# Altium schematic sheet PowCarbinBoard_Isolation.SchDoc
size A3
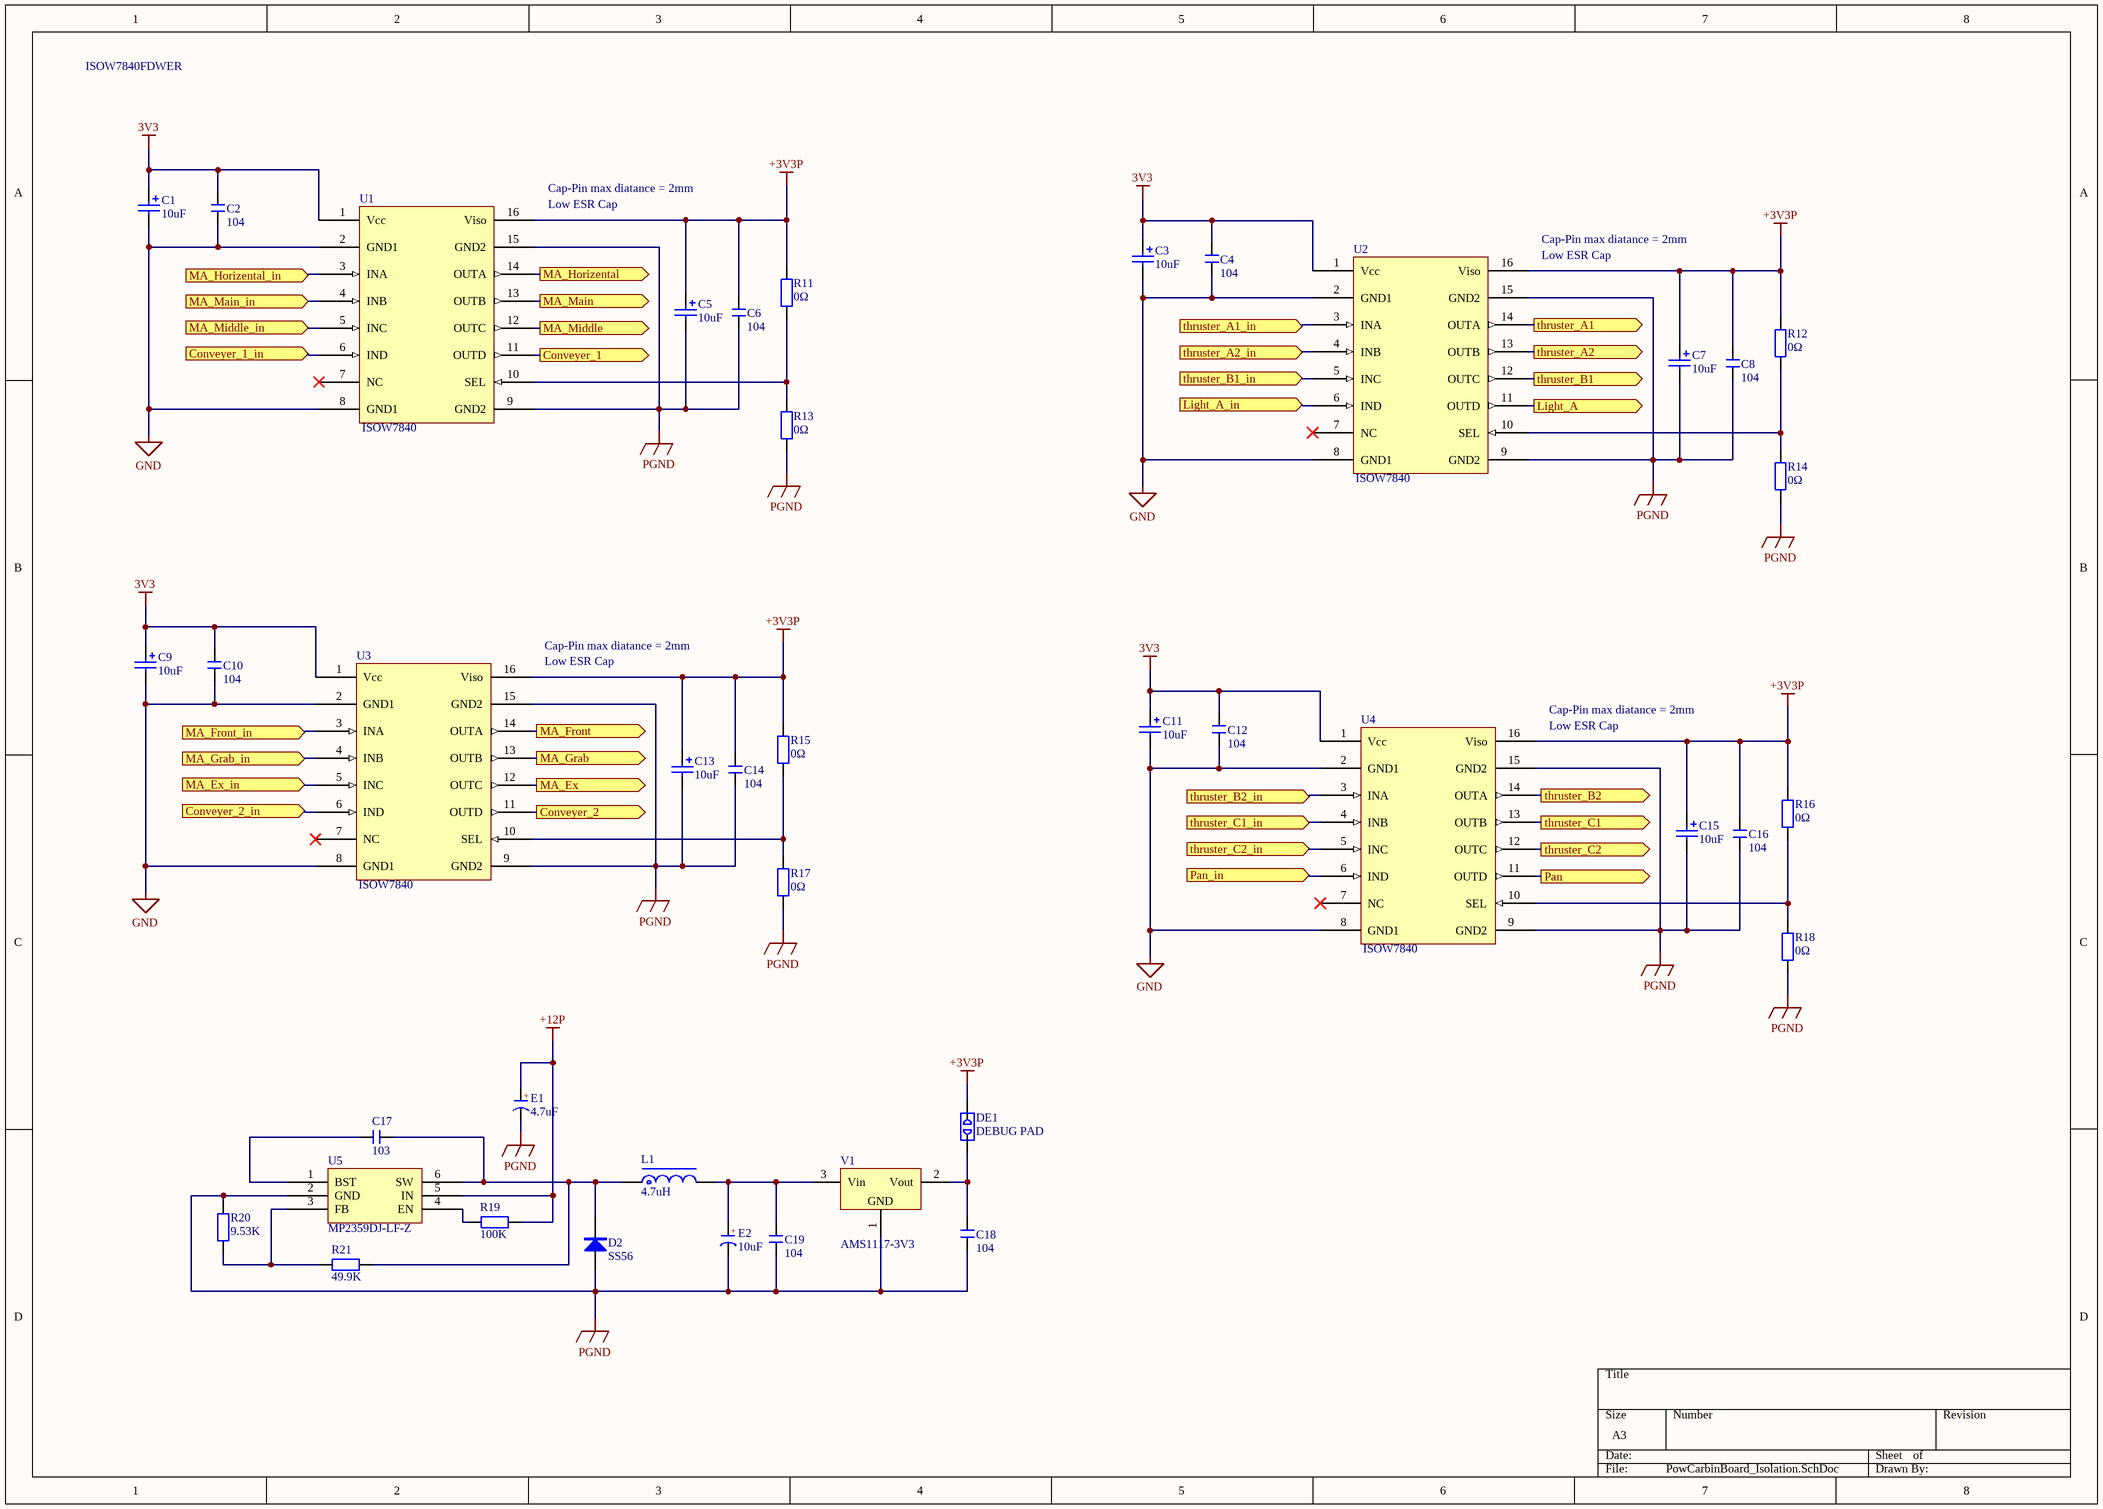
[diagram p0: PowCarbinBoard_Isolation.SchDoc]

## Parts
C1  10uF  [CASE-B_3528]
C2  104  [C 0603_L]
C3  10uF  [CASE-B_3528]
C4  104  [C 0603_L]
C5  10uF  [CASE-B_3528]
C6  104  [C 0603_L]
C7  10uF  [CASE-B_3528]
C8  104  [C 0603_L]
C9  10uF  [CASE-B_3528]
C10  104  [C 0603_L]
C11  10uF  [CASE-B_3528]
C12  104  [C 0603_L]
C13  10uF  [CASE-B_3528]
C14  104  [C 0603_L]
C15  10uF  [CASE-B_3528]
C16  104  [C 0603_L]
C17  103  [C 0603_L]
C18  104  [C 0603_L]
C19  104  [C 0603_L]
D2  SS56  [SMA]
DE1  DEBUG PAD  [DEBUG_A]
E1  4.7uF  [CM B(4*5.4)]
E2  10uF  [CM B(4*5.4)]
L1  4.7uH  [CDRH74]
R11  0Ω  [R 0603_L]
R12  0Ω  [R 0603_L]
R13  0Ω  [R 0603_L]
R14  0Ω  [R 0603_L]
R15  0Ω  [R 0603_L]
R16  0Ω  [R 0603_L]
R17  0Ω  [R 0603_L]
R18  0Ω  [R 0603_L]
R19  100K  [R 0603_L]
R20  9.53K  [R 0603_L]
R21  49.9K  [R 0603_L]
U1  ISOW7840  [ISOW7840]
U2  ISOW7840  [ISOW7840]
U3  ISOW7840  [ISOW7840]
U4  ISOW7840  [ISOW7840]
U5  MP2359DJ-LF-Z  [SOT-23-6]
V1  AMS1117-3V3  [SOT89_N]

## Ports
Conveyer_1 (out), Conveyer_1_in (in), Conveyer_2 (out), Conveyer_2_in (in), Light_A (out), Light_A_in (in), MA_Ex (out), MA_Ex_in (in), MA_Front (out), MA_Front_in (in), MA_Grab (out), MA_Grab_in (in), MA_Horizental (out), MA_Horizental_in (in), MA_Main (out), MA_Main_in (in), MA_Middle (out), MA_Middle_in (in), Pan (out), Pan_in (in), thruster_A1 (out), thruster_A1_in (in), thruster_A2 (out), thruster_A2_in (in), thruster_B1 (out), thruster_B1_in (in), thruster_B2 (out), thruster_B2_in (in), thruster_C1 (out), thruster_C1_in (in), thruster_C2 (out), thruster_C2_in (in)

## Nets
3V3: C1.1 C2.2 C3.1 C4.2 C9.1 C10.2 C11.1 C12.2 U1.1(Vcc) U2.1(Vcc) U3.1(Vcc) U4.1(Vcc)
+3V3P: C5.1 C6.2 C7.1 C8.2 C13.1 C14.2 C15.1 C16.2 DE1.2 R11.2 R12.2 R15.2 R16.2 U1.16(Viso) U2.16(Viso) U3.16(Viso) U4.16(Viso)
+12P: E1.1(A) R19.1 U5.5(IN)
GND: C1.2 C2.1 C3.2 C4.1 C9.2 C10.1 C11.2 C12.1 U1.2(GND1) U1.8(GND1) U2.2(GND1) U2.8(GND1) U3.2(GND1) U3.8(GND1) U4.2(GND1) U4.8(GND1)
PGND: C5.2 C6.1 C7.2 C8.1 C13.2 C14.1 C15.2 C16.1 C18.1 C19.1 D2.1(A) E1.2(K) E2.2(K) R13.1 R14.1 R17.1 R18.1 R20.2 U1.9(GND2) U1.15(GND2) U2.9(GND2) U2.15(GND2) U3.9(GND2) U3.15(GND2) U4.9(GND2) U4.15(GND2) U5.2(GND) V1.1(GND)
Conveyer_1: U1.11(OUTD) ; port Conveyer_1
Conveyer_1_in: U1.6(IND) ; port Conveyer_1_in
Conveyer_2: U3.11(OUTD) ; port Conveyer_2
Conveyer_2_in: U3.6(IND) ; port Conveyer_2_in
Light_A: U2.11(OUTD) ; port Light_A
Light_A_in: U2.6(IND) ; port Light_A_in
MA_Ex: U3.12(OUTC) ; port MA_Ex
MA_Ex_in: U3.5(INC) ; port MA_Ex_in
MA_Front: U3.14(OUTA) ; port MA_Front
MA_Front_in: U3.3(INA) ; port MA_Front_in
MA_Grab: U3.13(OUTB) ; port MA_Grab
MA_Grab_in: U3.4(INB) ; port MA_Grab_in
MA_Horizental: U1.14(OUTA) ; port MA_Horizental
MA_Horizental_in: U1.3(INA) ; port MA_Horizental_in
MA_Main: U1.13(OUTB) ; port MA_Main
MA_Main_in: U1.4(INB) ; port MA_Main_in
MA_Middle: U1.12(OUTC) ; port MA_Middle
MA_Middle_in: U1.5(INC) ; port MA_Middle_in
Pan: U4.11(OUTD) ; port Pan
Pan_in: U4.6(IND) ; port Pan_in
thruster_A1: U2.14(OUTA) ; port thruster_A1
thruster_A1_in: U2.3(INA) ; port thruster_A1_in
thruster_A2: U2.13(OUTB) ; port thruster_A2
thruster_A2_in: U2.4(INB) ; port thruster_A2_in
thruster_B1: U2.12(OUTC) ; port thruster_B1
thruster_B1_in: U2.5(INC) ; port thruster_B1_in
thruster_B2: U4.14(OUTA) ; port thruster_B2
thruster_B2_in: U4.3(INA) ; port thruster_B2_in
thruster_C1: U4.13(OUTB) ; port thruster_C1
thruster_C1_in: U4.4(INB) ; port thruster_C1_in
thruster_C2: U4.12(OUTC) ; port thruster_C2
thruster_C2_in: U4.5(INC) ; port thruster_C2_in
NetC17_1: C17.1 D2.2(K) L1.1 R21.2 U5.6(SW)
NetC17_2: C17.2 U5.1(BST)
NetC18_2: C18.2 DE1.1 V1.2(Vout)
NetC19_2: C19.2 E2.1(A) L1.2 V1.3(Vin)
NetR11_1: R11.1 R13.2 U1.10(SEL)
NetR12_1: R12.1 R14.2 U2.10(SEL)
NetR15_1: R15.1 R17.2 U3.10(SEL)
NetR16_1: R16.1 R18.2 U4.10(SEL)
NetR19_2: R19.2 U5.4(EN)
NetR20_1: R20.1 R21.1 U5.3(FB)

Not connected (* = marked no-connect by the designer): U1 7(NC)*; U2 7(NC)*; U3 7(NC)*; U4 7(NC)*

## Notes on the sheet
- ISOW7840FDWER
- Cap-Pin max diatance = 2mm
- (near U1) Low ESR Cap
- (near U2) Low ESR Cap
- (near U3) Low ESR Cap
- (near U4) Low ESR Cap
- (in symbol C-CM) +

## Library data of the parts
C1 C3 C5 C7 C9 C11 C13 C15 = 3528 100uF (107) 10% 6.3V: 钽电容; ComponentLink1Description: 供应商链接; ComponentLink1URL: http://www.szlcsc.com/product/details_16815.html; Package: 3528; Supplier: LC; SuppliersPartNumber: C16133
C2 C4 C6 C8 C10 C12 C14 C16-C19 = C: 无极性贴片电容; 版权归属: 源创客; BOM名称: 无极性贴片电容; 学习资源: www.ooocke.com
D2 = SS14: 肖特基二极管; 版权归属: 源创客; 属性: 40V/1A; BOM名称: 肖特基二极管; 学习资源: www.ooocke.com
DE1 = DEBUG: 调试断点焊盘; 版权归属: 源创客; BOM名称: 调试断点焊盘; 学习资源: www.ooocke.com
E1 E2 = C-CM: 贴片电解电容; 版权归属: 源创客; BOM名称: 贴片电解电容; 学习资源: www.ooocke.com
L1 = L-CDRH: 功率屏蔽电感; 版权归属: 源创客; BOM名称: 功率屏蔽电感; 学习资源: www.ooocke.com
R11-R21 = R: 贴片电阻; 版权归属: 源创客; BOM名称: 贴片电阻; 学习资源: www.ooocke.com
U5 = MP2359DJ-LF-Z_[C14259]: DC-DC芯片; ComponentLink1Description: 供应商链接; ComponentLink1URL: http://www.szlcsc.com/product/details_14917.html; Package: SOT-23-6; Supplier: LC; SuppliersPartNumber: C14259
V1 = AMS1117: 三端稳压芯片; BOM名称: 稳压芯片; 版权归属: 源创客; 学习资源: www.ooocke.com